# Altium project RCS STM32.PrjPcb
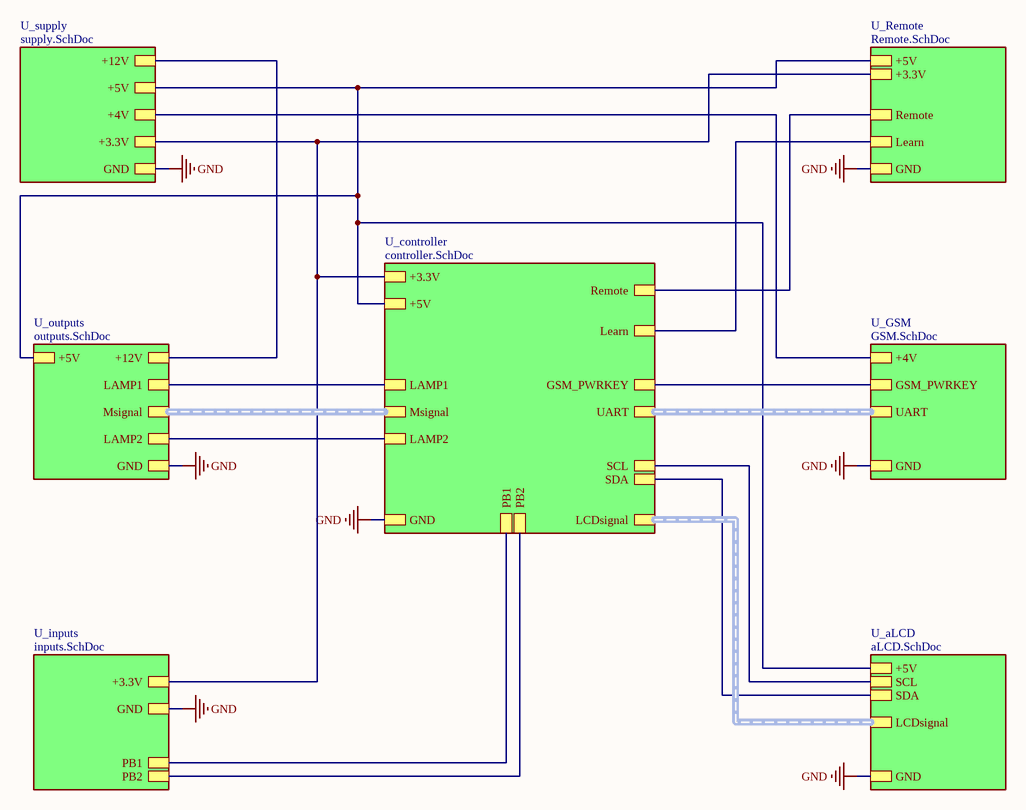
[diagram p0: main.SchDoc]
8 sheets, 165 parts. Net scope: strictly hierarchical (ports join the sheet entries above them; power ports are local).
Board file: PCB.PcbDoc
Sheets:
  main.SchDoc
    U_aLCD = aLCD.SchDoc
    U_controller = controller.SchDoc
    U_GSM = GSM.SchDoc
    U_inputs = inputs.SchDoc
    U_outputs = outputs.SchDoc
    U_Remote = Remote.SchDoc
    U_supply = supply.SchDoc

## Sheet main.SchDoc
size A4; SheetNumber: 1; SheetTotal: 8

### Sub-sheets
U_aLCD = aLCD.SchDoc: +5V, GND, LCDsignal (harness LCDsignal), SCL, SDA
U_controller = controller.SchDoc: +3.3V, GND, Msignal (harness Msignal), LCDsignal (harness LCDsignal), UART (harness UART), Remote, LAMP1, LAMP2, PB1, PB2, +5V, Learn, GSM_PWRKEY, SCL, SDA
U_GSM = GSM.SchDoc: +4V, GND, UART (harness UART), GSM_PWRKEY
U_inputs = inputs.SchDoc: GND, +3.3V, PB1, PB2
U_outputs = outputs.SchDoc: +12V, GND, Msignal (harness Msignal), +5V, LAMP1, LAMP2
U_Remote = Remote.SchDoc: +5V, GND, Remote, Learn, +3.3V
U_supply = supply.SchDoc: +12V, +5V, +4V, +3.3V, GND

### Nets
+3V3: sheet U_controller/+3.3V, sheet U_inputs/+3.3V, sheet U_Remote/+3.3V, sheet U_supply/+3.3V
+4V: sheet U_GSM/+4V, sheet U_supply/+4V
+5V: sheet U_aLCD/+5V, sheet U_controller/+5V, sheet U_outputs/+5V, sheet U_Remote/+5V, sheet U_supply/+5V
+12V: sheet U_outputs/+12V, sheet U_supply/+12V
GND: sheet U_aLCD/GND, sheet U_controller/GND, sheet U_GSM/GND, sheet U_inputs/GND, sheet U_outputs/GND, sheet U_Remote/GND, sheet U_supply/GND
GSM_PWRKEY: sheet U_controller/GSM_PWRKEY, sheet U_GSM/GSM_PWRKEY
LAMP1: sheet U_controller/LAMP1, sheet U_outputs/LAMP1
LAMP2: sheet U_controller/LAMP2, sheet U_outputs/LAMP2
Learn: sheet U_controller/Learn, sheet U_Remote/Learn
PB1: sheet U_controller/PB1, sheet U_inputs/PB1
PB2: sheet U_controller/PB2, sheet U_inputs/PB2
Remote: sheet U_controller/Remote, sheet U_Remote/Remote
SCL: sheet U_aLCD/SCL, sheet U_controller/SCL
SDA: sheet U_aLCD/SDA, sheet U_controller/SDA

### Buses and harness runs
harness sheet U_aLCD/LCDsignal = sheet U_controller/LCDsignal
harness sheet U_controller/Msignal = sheet U_outputs/Msignal
harness sheet U_controller/UART = sheet U_GSM/UART

## Sheet aLCD.SchDoc
size A4; SheetNumber: 7; SheetTotal: 8
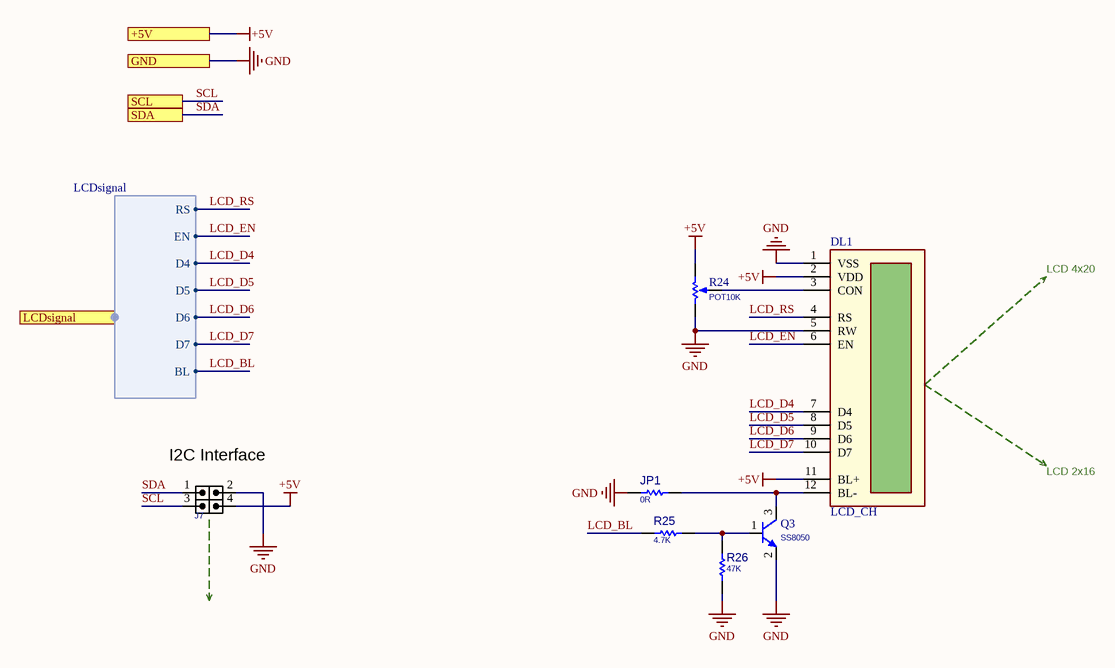
[diagram p1: aLCD.SchDoc]

### Parts
DL1  LCD_CH  [LCD_CH]
J7  HDRM_2X2  [HDR_M_2X2]  (value not drawn)
JP1  0R  [R0805]
Q3  SS8050  [SOT23_3]
R24  POT10K  [POT_7X5]
R25  4.7K  [R0805]
R26  47K  [R0805]

### Ports
+5V, GND, LCDsignal (harness LCDsignal), SCL, SDA

### Harnesses
LCDsignal: RS, EN, D4, D5, D6, D7, BL

### Nets
+5V: DL1.2(VDD) DL1.11(BL+) J7.4 R24.1(TOP) ; port +5V
GND: DL1.1(VSS) DL1.5(RW) J7.2 JP1.2 Q3.2(E) R24.3(BOT) R26.2 ; port GND
LCD_BL: R25.2 ; port LCDsignal.BL
LCD_D4: DL1.7(D4) ; port LCDsignal.D4
LCD_D5: DL1.8(D5) ; port LCDsignal.D5
LCD_D6: DL1.9(D6) ; port LCDsignal.D6
LCD_D7: DL1.10(D7) ; port LCDsignal.D7
LCD_EN: DL1.6(EN) ; port LCDsignal.EN
LCD_RS: DL1.4(RS) ; port LCDsignal.RS
SCL: J7.3 ; port SCL
SDA: J7.1 ; port SDA
NetDL1_3: DL1.3(CON) R24.2(TAP)
NetDL1_12: DL1.12(BL-) JP1.1 Q3.3(C)
NetQ3_1: Q3.1(B) R25.1 R26.1

### Notes on the sheet
- LCD 4x20
- (near J7) I2C Interface
- LCD 2x16

### Library data of the parts
DL1 = LCD_CH: alphanumeric lcd  2x16
J7 = HDR_M_2X2: CONN, HEADER, Male, pitch: 2.54mm, 4POS; MANF_P#: MANF_PART#; MANF: MANF; VALUE: HDRM_2X2
JP1 R25 R26 = RES_SMD_0805: RESISTOR, SMD; PARAM: -W; DESC: DESCRIPTION; DIST#: MOUSER; PARAM2: 1%; MANF_P#: -; MANF: -; ASSEMBLY: ASSEMBLY; PRICE: 100= 0.5$
  JP1: VALUE: 0R
  R25: VALUE: 4.7K
  R26: VALUE: 47K
Q3 = NPN_SS8050_SOT23: BJT, NPN, 25v, 1.5A, SMD, SOT23; PARAM2: 300mW; MANF: GALAXY; PARAM: 25v, 1.5A; MANF_P#: SS8050; VALUE: SS8050
R24 = RES_THD_POT_7X5: RESISTOR, THD, Potentiometer; VALUE: POT10K

## Sheet controller.SchDoc
size A4; SheetNumber: 3; SheetTotal: 8
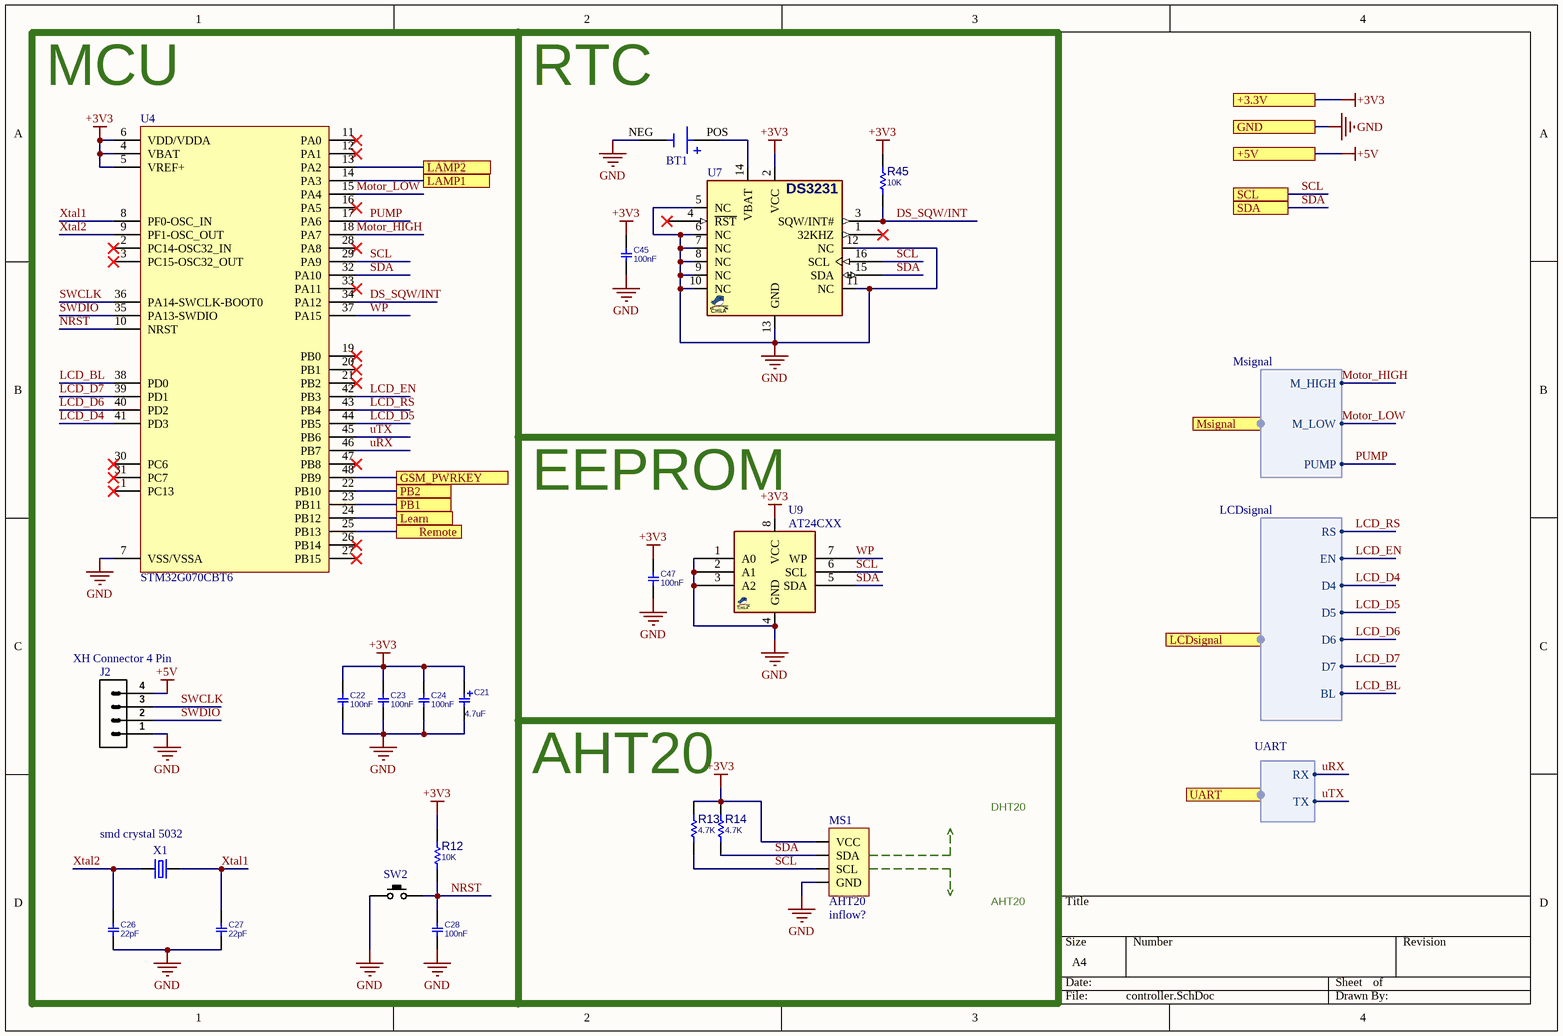
[diagram p2: controller.SchDoc]

### Parts
BT1  Coin Cell battery holder  [Coin Cell battery holder]  (value not drawn)
C21  4.7uF  [C_TN_3216]
C22  100nF  [C0805]
C23  100nF  [C0805]
C24  100nF  [C0805]
C26  22pF  [C0805]
C27  22pF  [C0805]
C28  100nF  [C0805]
C45  100nF  [C0805]
C47  100nF  [C0805]
J2  XH Connector 4 Pin  [XH 4 Pin - 2.5mm]
MS1  Inflow: inflow?  [AHT20]  (hidden comment: AHT20)
R12  10K  [R0805]
R13  4.7K  [R0805]
R14  4.7K  [R0805]
R45  10K  [R0805]
SW2  Tactile Switch  [Tactile Switch]  (value not drawn)
U4  STM32G070CBT6  [STM32G070CBT6]
U7  DS3231  [SO_16_W]  (value not drawn)
U9  AT24CXX  [SO_8]
X1  smd crystal 5032  [smd crystal 5032]

### Blocks framed on the sheet
MCU: C21-C24 C26-C28 J2 R12 SW2 U4 X1

### Ports
+3.3V, +5V, GND, GSM_PWRKEY, LAMP1, LAMP2, LCDsignal (harness LCDsignal), Learn, Msignal (harness Msignal), PB1, PB2, Remote, SCL, SDA, UART (harness UART)

### Harnesses
Msignal: M_HIGH, M_LOW, PUMP
LCDsignal: RS, EN, D4, D5, D6, D7, BL
UART: RX, TX

### Nets
+3V3: C21.1 C22.2 C23.2 C24.2 C45.2 C47.2 MS1.4(VCC) R12.1 R13.1 R14.1 R45.1 U4.4(VBAT) U4.5(VREF+) U4.6(VDD/VDDA) U7.2(VCC) U9.8(VCC) ; port +3.3V
+5V: J2.4 ; port +5V
GND: BT1.NEG C21.2 C22.1 C23.1 C24.1 C26.2 C27.2 C28.1 C45.1 C47.1 J2.1 MS1.3(GND) SW2.1(P1) U4.7(VSS/VSSA) U7.5(NC) U7.6(NC) U7.7(NC) U7.8(NC) U7.9(NC) U7.10(NC) U7.11(NC) U7.12(NC) U7.13(GND) U9.1(A0) U9.2(A1) U9.3(A2) U9.4(GND) ; port GND
DS_SQW/INT: R45.2 U4.34(PA12) U7.3(SQW/INT#)
GSM_PWRKEY: U4.48(PB9) ; port GSM_PWRKEY
LAMP1: U4.14(PA3) ; port LAMP1
LAMP2: U4.13(PA2) ; port LAMP2
LCD_BL: U4.38(PD0) ; port LCDsignal.BL
LCD_D4: U4.41(PD3) ; port LCDsignal.D4
LCD_D5: U4.44(PB5) ; port LCDsignal.D5
LCD_D6: U4.40(PD2) ; port LCDsignal.D6
LCD_D7: U4.39(PD1) ; port LCDsignal.D7
LCD_EN: U4.42(PB3) ; port LCDsignal.EN
LCD_RS: U4.43(PB4) ; port LCDsignal.RS
Learn: U4.24(PB12) ; port Learn
Motor_HIGH: U4.18(PA7) ; port Msignal.M_HIGH
Motor_LOW: U4.15(PA4) ; port Msignal.M_LOW
NRST: C28.2 R12.2 SW2.2(P3) U4.10(NRST)
PB1: U4.23(PB11) ; port PB1
PB2: U4.22(PB10) ; port PB2
PUMP: U4.17(PA6) ; port Msignal.PUMP
Remote: U4.25(PB13) ; port Remote
SCL: MS1.2(SCL) R13.2 U4.29(PA9) U7.16(SCL) U9.6(SCL) ; port SCL
SDA: MS1.1(SDA) R14.2 U4.32(PA10) U7.15(SDA) U9.5(SDA) ; port SDA
SWCLK: J2.3 U4.36(PA14-SWCLK-BOOT0)
SWDIO: J2.2 U4.35(PA13-SWDIO)
uRX: U4.46(PB7) ; port UART.RX
uTX: U4.45(PB6) ; port UART.TX
WP: U4.37(PA15) U9.7(WP)
Xtal1: C27.1 U4.8(PF0-OSC_IN) X1.2
Xtal2: C26.1 U4.9(PF1-OSC_OUT) X1.1
NetBT1_POS: BT1.POS U7.14(VBAT)

Not connected (* = marked no-connect by the designer): U4 1(PC13)* 2(PC14-OSC32_IN)* 3(PC15-OSC32_OUT)* 11(PA0)* 12(PA1)* 16(PA5)* 19(PB0)* 20(PB1)* 21(PB2)* 26(PB14)* 27(PB15)* 28(PA8)* 30(PC6)* 31(PC7)* 33(PA11)* 47(PB8)*; U7 1(32KHZ)* 4(~{RST})*

### Notes on the sheet
- RTC
- (near U9) EEPROM
- AHT20
- DHT20

### Library data of the parts
BT1 = Coin Cell battery holder: 2032 Battery
C21 = CAP_SMD_TAN: CAP, SMD, TAN,; PARAM2: -V; VALUE: 4.7uF
C22-C24 C28 C45 C47 = CAP_SMD_MLCC_0805: CAP, MLCC, -F, -V, MATERIAL, -%, 0201; PARAM: -, -%; MANF_P#: MANF_PART#; PRICE: 100= 1$; MANF: -; PARAM2: -V; ASSEMBLY: ASSEMBLY; VALUE: 100nF
C26 C27 = CAP_SMD_MLCC_0805: CAP, MLCC, -F, -V, MATERIAL, -%, 0201; PARAM: -, -%; MANF_P#: MANF_PART#; VALUE: 100nF; PRICE: 100= 1$; MANF: -; PARAM2: -V; ASSEMBLY: ASSEMBLY
J2 = XH 4: XH, 4-Pin; Current: 3A; Library Link: https://github.com/Majid-Derhambakhsh; Publisher: Majid Derhambakhsh
MS1 = ModSen_AHT20: Air Temperature and Humidity Sensor; Rating: Rating?; Validation: NT; Package: Dip; Type: Air T&H; Value: AHT20
R12-R14 R45 = RES_SMD_0805: as JP1 on sheet aLCD; MANF_P#: -; MANF: -; ASSEMBLY: ASSEMBLY; PRICE: 100= 0.5$
  R12 R45: VALUE: 10K
  R13 R14: VALUE: 4.7K
SW2 = Tactile Switch: 3x6x5 mm - 2 Pin
U4 = STM32G070CBT6: ARMÂ® CortexÂ®-M0+ STM32G0 Microcontroller IC 32-Bit 64MHz 128KB _128K x 8_ FLASH 48-LQFP _7x7_
U7 = DS3231_SOP16W: Real-Time Clock, I2C, +IntCryst; MANF: Maxim Integrated; MANF_P#: DS3231SN#; PARAM2: 2.3~5.5V; PARAM: I2C, +IntCryst, -40~85°C; VALUE: DS3231; PRICE: 10$
U9 = EEPROM_I2C_AT24CXX_SOP8: EEPROM, I2C,; Value: AT24CXX
X1 = smd crystal 5032: 8Mhz - 2Pin - 5032 Package

## Sheet GSM.SchDoc
size A4; SheetNumber: 6; SheetTotal: 8
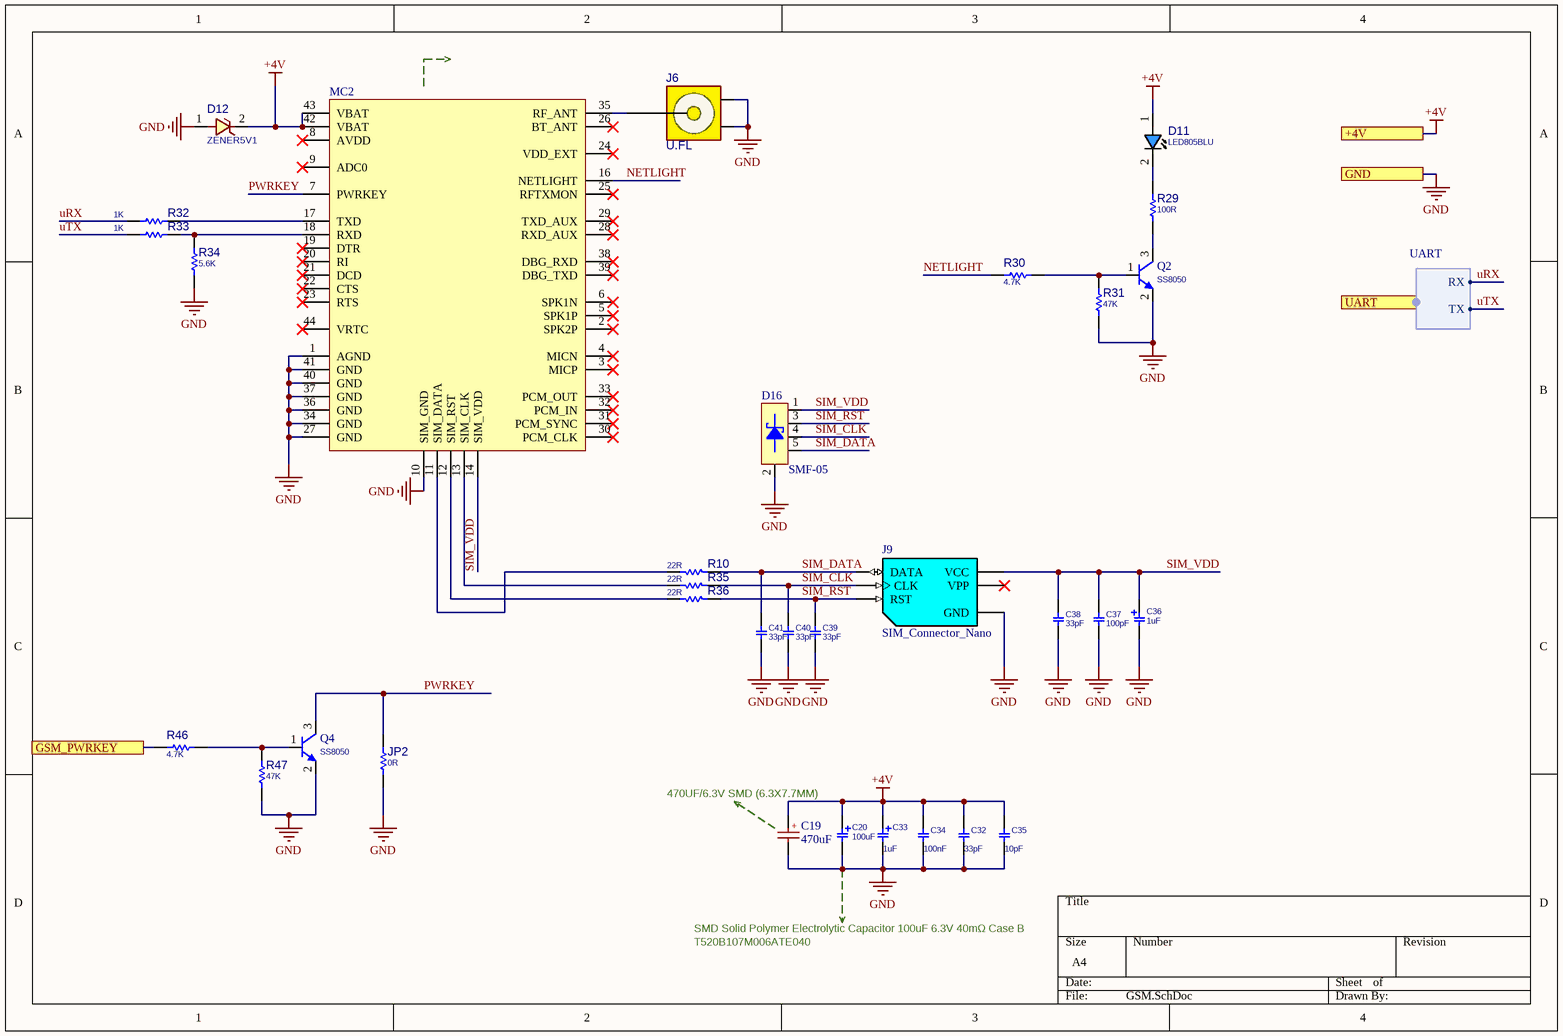
[diagram p3: GSM.SchDoc]

### Parts
C19  470uF  [Cap SMD 6.3x7.7mm]
C20  100uF  [C_TN_3528_BLK]
C32  33pF  [C0603]
C33  1uF  [C_TN_3216]
C34  100nF  [C0805]
C35  10pF  [C0603]
C36  1uF  [C_TN_3216]
C37  100pF  [C0805]
C38  33pF  [C0805]
C39  33pF  [C0805]
C40  33pF  [C0805]
C41  33pF  [C0805]
D11  LED805BLU  [LED0805BLU]
D12  ZENER5V1  [D_SOD123W]
D16  SMF-05  [SC70-5_N]
J6  U.FL  [UFL]
J9  SIM_Connector_Nano  [SIM_Connector_Nano]
JP2  0R  [R0805]
MC2  M66  [m66]  (value not drawn)
Q2  SS8050  [SOT23_3]
Q4  SS8050  [SOT23_3]
R10  22R  [R0805]
R29  100R  [R0805]
R30  4.7K  [R0805]
R31  47K  [R0805]
R32  1K  [R0805]
R33  1K  [R0805]
R34  5.6K  [R0805]
R35  22R  [R0805]
R36  22R  [R0805]
R46  4.7K  [R0805]
R47  47K  [R0805]

### Ports
+4V, GND, GSM_PWRKEY, UART (harness UART)

### Harnesses
UART: RX, TX

### Nets
+4V: C19.1(+) C20.1 C32.1 C33.1 C34.2 C35.1 D11.1(ANODE) D12.2 MC2.42(VBAT) MC2.43(VBAT) ; port +4V
GND: C19.2(-) C20.2 C32.2 C33.2 C34.1 C35.2 C36.2 C37.1 C38.1 C39.1 C40.1 C41.1 D12.1 D16.2(K) J6.2(G1) J6.3(G2) J9.C5(GND) JP2.1 MC2.1(AGND) MC2.10(SIM_GND) MC2.27(GND) MC2.34(GND) MC2.36(GND) MC2.37(GND) MC2.40(GND) MC2.41(GND) Q2.2(E) Q4.2(E) R31.1 R34.1 R47.1 ; port GND
GSM_PWRKEY: R46.1 ; port GSM_PWRKEY
NETLIGHT: MC2.16(NETLIGHT) R30.1
PWRKEY: JP2.2 MC2.7(PWRKEY) Q4.3(C)
SIM_CLK: C40.2 D16.4(K) J9.C3(CLK) R35.1
SIM_DATA: C41.2 D16.5(K) J9.C7(DATA) R10.1
SIM_RST: C39.2 D16.3(K) J9.C2(RST) R36.1
SIM_VDD: C36.1 C37.2 C38.2 D16.1(K) J9.C1(VCC) MC2.14(SIM_VDD)
uRX: R32.1 ; port UART.RX
uTX: R33.1 ; port UART.TX
NetD11_2: D11.2(CATHODE) R29.2
NetJ6_1: J6.1(SIG) MC2.35(RF_ANT)
NetMC2_11: MC2.11(SIM_DATA) R10.2
NetMC2_12: MC2.12(SIM_RST) R36.2
NetMC2_13: MC2.13(SIM_CLK) R35.2
NetMC2_17: MC2.17(TXD) R32.2
NetMC2_18: MC2.18(RXD) R33.2 R34.2
NetQ2_1: Q2.1(B) R30.2 R31.2
NetQ2_3: Q2.3(C) R29.1
NetQ4_1: Q4.1(B) R46.2 R47.2

Not connected (* = marked no-connect by the designer): J9 C6(VPP)*; MC2 2(SPK2P)* 3(MICP)* 4(MICN)* 5(SPK1P)* 6(SPK1N)* 8(AVDD)* 9(ADC0)* 19(DTR)* 20(RI)* 21(DCD)* 22(CTS)* 23(RTS)* 24(VDD_EXT)* 25(RFTXMON)* 26(BT_ANT)* 28(RXD_AUX)* 29(TXD_AUX)* 30(PCM_CLK)* 31(PCM_SYNC)* 32(PCM_IN)* 33(PCM_OUT)* 38(DBG_RXD)* 39(DBG_TXD)* 44(VRTC)*

### Notes on the sheet
- 470UF/6.3V SMD (6.3X7.7MM)
- SMD Solid Polymer Electrolytic Capacitor 100uF 6.3V 40mΩ Case B
- T520B107M006ATE040

### Library data of the parts
C19 = CAP Electrolytic SMD: SMD Aluminum Electrolytic Capacitor; Desc: SMD Aluminum Electrolytic Capacitors; Value: 100uF; Voltage: 12v; Tolerance: 5%; Library Link: https://github.com/Majid-Derhambakhsh; Publisher: Majid Derhambakhsh
C20 = CAP_SMD_TAN_4: CAP, SMD, TAN; PARAM: 20%, 300mOhm, -55~105oC; MANF: VISHAY; MANF_P#: T55A106M6R3C0300; PARAM2: 6.3V; PRICE: 0.46$; VALUE: 100uF
C32 C35 = CAP_SMD_MLCC_0603: CAP, MLCC, -F, -V, MATERIAL, -%, 0201; PARAM: -, -%; MANF_P#: MANF_PART#; PRICE: 100= 1$; MANF: -; PARAM2: -V; ASSEMBLY: ASSEMBLY
  C32: VALUE: 33pF
  C35: VALUE: 10pF
C33 C36 = CAP_SMD_TAN: CAP, SMD, TAN,; PARAM2: -V; VALUE: 1uF
C34 C37-C41 = CAP_SMD_MLCC_0805: as C22 on sheet controller; PRICE: 100= 1$; MANF: -; PARAM2: -V; ASSEMBLY: ASSEMBLY
  C34: VALUE: 100nF
  C37: VALUE: 100pF
  C38-C41: VALUE: 33pF
D11 = LED_SMD_0805_BLU: LED, SMD, 0805, BLUE; DESC: DESCRIPTION; MANF_P#: MANF_PART#; PARAM2: 2.2V; MANF: MANF; ASSEMBLY: ASSEMBLY; PRICE: 36t@Javan; VALUE: LED805BLU
D12 = DIODE_SMD_ZENER_BZT52HC5V1: DIODE, ZENER, 1W, 5.1V; MANF: Diodes; DESC: DESCRIPTION; PARAM2: 1W, 4Ohm, -55~150oC; MANF_P#: BZT52HC5V1WF-7; ASSEMBLY: ASSEMBLY; PRICE: 0.25$; PARAM: 5.1V; VALUE: ZENER5V1
D16 = Semi_Diod_TVS_SMF05: TVS Diode Array; Rating: Rating?; Validation: Valid; Inflow: inflow?; Type: TVS; Value: SMF-05; Package: SC70-5
J6 = CONN_RF_UFL: CONN, RF, U.FL, STRAIGHT, Ultra Miniature Coaxial; MANF_P#: CONUFL001-SMD, U.FL-R-SMT-1(10), 128-0711-201; MANF: Linx, Hirose, Cinch; PARAM: 50Ohm, 6GHz; DESC: DESCRIPTION; DIST#: DIGIKEY, MOUSER; PARAM2: GOLD; ASSEMBLY: ASSEMBLY; PRICE: 0.9$; VALUE: U.FL
J9 = SIM_Connector_Nano: Nano SimCard Holder 6P
JP2 R10 R29-R36 R46 R47 = RES_SMD_0805: as JP1 on sheet aLCD; MANF_P#: -; MANF: -; ASSEMBLY: ASSEMBLY; PRICE: 100= 0.5$
  JP2: VALUE: 0R
  R10 R35 R36: VALUE: 22R
  R29: VALUE: 100R
  R30 R46: VALUE: 4.7K
  R31 R47: VALUE: 47K
  R32 R33: VALUE: 1K
  R34: VALUE: 5.6K
MC2 = ModSen_Com_M66: Quectel GSM/GPRS Module; Rating: Rating?; Validation: Valid; Inflow: inflow?; Package: Dip; Value: M66; Type: GSM-GPRS
Q2 Q4 = NPN_SS8050_SOT23: as Q3 on sheet aLCD; PARAM: 25v, 1.5A; MANF_P#: SS8050; VALUE: SS8050

## Sheet inputs.SchDoc
size A4; SheetNumber: 5; SheetTotal: 8
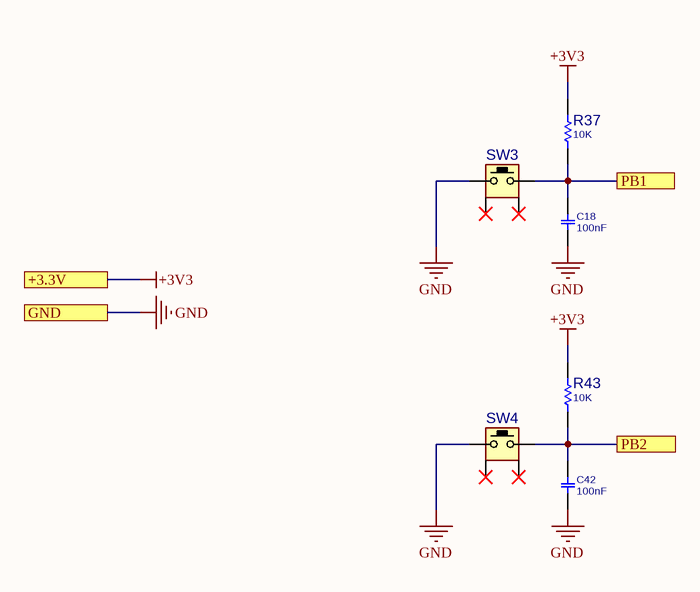
[diagram p4: inputs.SchDoc]

### Parts
C18  100nF  [C0805]
C42  100nF  [C0805]
R37  10K  [R0805]
R43  10K  [R0805]
SW3  PUSHBUTTON  [SWPBT_SPST_R_6X6X10]  (value not drawn)
SW4  PUSHBUTTON  [SWPBT_SPST_R_6X6X10]  (value not drawn)

### Ports
+3.3V, GND, PB1, PB2

### Nets
+3V3: R37.1 R43.1 ; port +3.3V
GND: C18.1 C42.1 SW3.1 SW4.1 ; port GND
PB1: C18.2 R37.2 SW3.2 ; port PB1
PB2: C42.2 R43.2 SW4.2 ; port PB2

Not connected (* = marked no-connect by the designer): SW3 MH1* MH2*; SW4 MH1* MH2*

### Library data of the parts
C18 C42 = CAP_SMD_MLCC_0805: as C22 on sheet controller; PRICE: 100= 1$; MANF: -; PARAM2: -V; ASSEMBLY: ASSEMBLY; VALUE: 100nF
R37 R43 = RES_SMD_0805: as JP1 on sheet aLCD; MANF_P#: -; MANF: -; ASSEMBLY: ASSEMBLY; PRICE: 100= 0.5$; VALUE: 10K
SW3 SW4 = SWPBT_SPST_R_6X6X10: SWITCH, PUSH BUTTON, TACTILE, THD, SPST, RIGHT; PARAM: 50mA/12VDC; DESC: DESCRIPTION; MANF: -; VALUE: PUSHBUTTON; ASSEMBLY: ASSEMBLY; PRICE: 0.3$; MANF_P#: -

## Sheet outputs.SchDoc
size A4; SheetNumber: 4; SheetTotal: 8
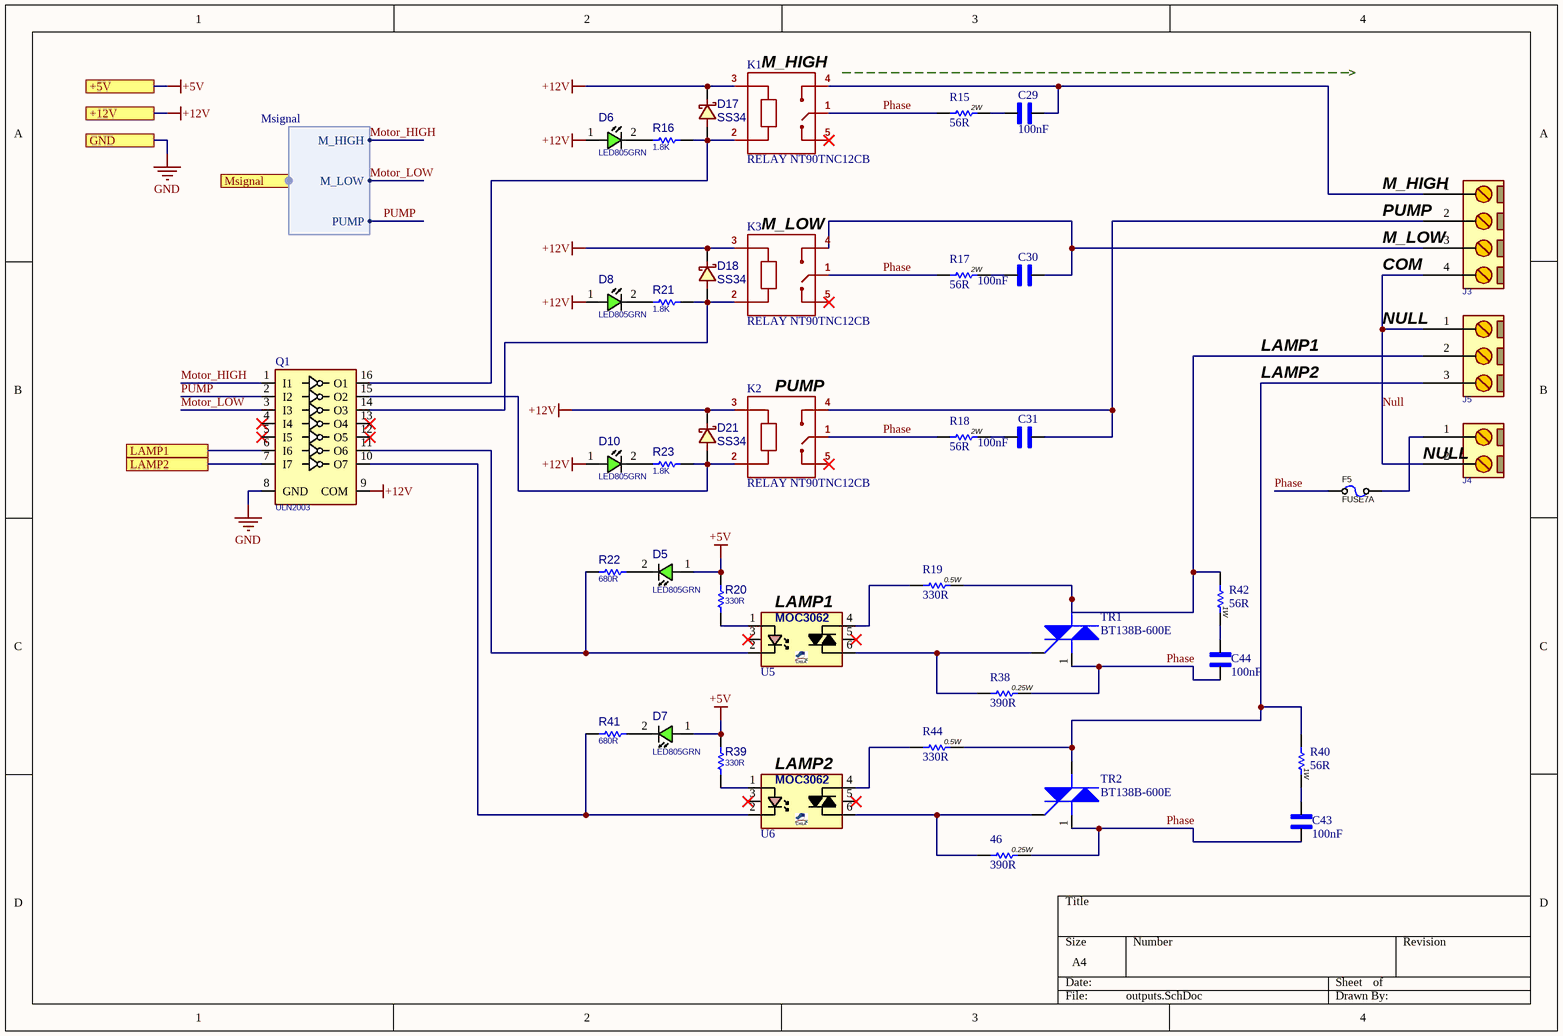
[diagram p5: outputs.SchDoc]

### Parts
46  390R  [Res THD 0.25w]
C29  100nF  [Capacitor Film]
C30  100nF  [Capacitor Film]
C31  100nF  [Capacitor Film]
C43  100nF  [Capacitor Film]
C44  100nF  [Capacitor Film]
D5  LED805GRN  [LED0805GRN]
D6  LED805GRN  [LED0805GRN]
D7  LED805GRN  [LED0805GRN]
D8  LED805GRN  [LED0805GRN]
D10  LED805GRN  [LED0805GRN]
D17  SS34  [D_SMB]
D18  SS34  [D_SMB]
D21  SS34  [D_SMB]
F5  FUSE7A  [FUSH_5X20MM]
J3  CONN_GMSTB4  [GMSTB762_4]  (value not drawn)
J4  CONN_GMSTB2  [GMSTB762_2]  (value not drawn)
J5  CONN_GMSTB3  [GMSTB762_3]  (value not drawn)
K1  RELAY NT90TNC12CB  [RELAY NT90TNC12CB]
K2  RELAY NT90TNC12CB  [RELAY NT90TNC12CB]
K3  RELAY NT90TNC12CB  [RELAY NT90TNC12CB]
Q1  ULN2003  [SO_16]
R15  56R  [Res THD 2w]
R16  1.8K  [R0805]
R17  56R  [Res THD 2w]
R18  56R  [Res THD 2w]
R19  330R  [Res THD 0.5w]
R20  330R  [R0805]
R21  1.8K  [R0805]
R22  680R  [R0805]
R23  1.8K  [R0805]
R38  390R  [Res THD 0.25w]
R39  330R  [R0805]
R40  56R  [Res THD 1w]
R41  680R  [R0805]
R42  56R  [Res THD 1w]
R44  330R  [Res THD 0.5w]
TR1  BT138B-600E  [BT138B-600E]
TR2  BT138B-600E  [BT138B-600E]
U5  MOC3062  [DIP_6SMD]  (value not drawn)
U6  MOC3062  [DIP_6SMD]  (value not drawn)

### Ports
+5V, +12V, GND, LAMP1, LAMP2, Msignal (harness Msignal)

### Harnesses
Msignal: M_HIGH, M_LOW, PUMP

### Nets
+5V: D5.1(ANODE) D7.1(ANODE) R20.1 R39.1 ; port +5V
+12V: D6.1(ANODE) D8.1(ANODE) D10.1(ANODE) D17.2 D18.2 D21.2 K1.3(A) K2.3(A) K3.3(A) Q1.9(COM) ; port +12V
GND: Q1.8(GND) ; port GND
LAMP1: Q1.6(I6) ; port LAMP1
LAMP2: Q1.7(I7) ; port LAMP2
Motor_HIGH: Q1.1(I1) ; port Msignal.M_HIGH
Motor_LOW: Q1.3(I3) ; port Msignal.M_LOW
Null: J3.4 J4.2 J5.1
Phase: 46.2 C43.2 C44.2 F5.1 K1.1(COM) K2.1(COM) K3.1(COM) R15.1 R17.1 R18.1 R38.2 TR1.1(T1) TR2.1(T1)
PUMP: Q1.2(I2) ; port Msignal.PUMP
Net46_1: 46.1 TR2.3(G) U6.6(A/K)
NetC29_1: C29.1 R15.2
NetC29_2: C29.2 J3.1 K1.4(N.O)
NetC30_1: C30.1 R17.2
NetC30_2: C30.2 J3.3 K3.4(N.O)
NetC31_1: C31.1 R18.2
NetC31_2: C31.2 J3.2 K2.4(N.O)
NetC43_1: C43.1 R40.2
NetC44_1: C44.1 R42.2
NetD5_2: D5.2(CATHODE) R22.1
NetD6_2: D6.2(CATHODE) R16.1
NetD7_2: D7.2(CATHODE) R41.1
NetD8_2: D8.2(CATHODE) R21.1
NetD10_2: D10.2(CATHODE) R23.1
NetD17_1: D17.1 K1.2(A) Q1.16(O1) R16.2
NetD18_1: D18.1 K3.2(A) Q1.14(O3) R21.2
NetD21_1: D21.1 K2.2(A) Q1.15(O2) R23.2
NetF5_2: F5.2 J4.1
NetJ5_2: J5.2 R19.2 R42.1 TR1.2_4(T2)
NetJ5_3: J5.3 R40.1 R44.2 TR2.2_4(T2)
NetQ1_10: Q1.10(O7) R41.2 U6.2(K)
NetQ1_11: Q1.11(O6) R22.2 U5.2(K)
NetR19_1: R19.1 U5.4(A/K)
NetR20_2: R20.2 U5.1(A)
NetR38_1: R38.1 TR1.3(G) U5.6(A/K)
NetR39_2: R39.2 U6.1(A)
NetR44_1: R44.1 U6.4(A/K)

Not connected (* = marked no-connect by the designer): K1 5(N.C)*; K2 5(N.C)*; K3 5(N.C)*; Q1 4(I4)* 5(I5)* 12(O5)* 13(O4)*; U5 3(NC)* 5(NC)*; U6 3(NC)* 5(NC)*

### Notes on the sheet
- (near K1) M_HIGH
- (near K3) M_LOW
- (near J3) PUMP
- (near J3) M_HIGH
- (near J3) M_LOW
- COM
- LAMP2
- LAMP1
- NULL
- (near K2) PUMP
- (near J4) NULL
- (near U5) LAMP1
- (near U6) LAMP2
- (in symbol Res THD 0.5w) 0.5W
- (in symbol Res THD 0.25w) 0.25W

### Library data of the parts
46 R38 = Res THD 0.25w: Resistor 1/4W; Rating: 0.25w; Value: 390R; Type: 10%; Package: THD
C29-C31 C43 C44 = Capacitor Film: Capacitor Film Pitch=10mm
D5-D8 D10 = LED_SMD_0805_GRN: LED, SMD, 0805, GREEN; PARAM: 20mA; DESC: DESCRIPTION; PARAM2: 2.2V; MANF: -; ASSEMBLY: ASSEMBLY; PRICE: 36t@Javan; MANF_P#: -; VALUE: LED805GRN
D17 D18 D21 = DIODE_SMD_SCHOTTKY_SS34: DIODE, SCHOTTKY, 20V, 3A; MANF: VISHAY; DESC: DESCRIPTION; MANF_P#: SS34; ASSEMBLY: ASSEMBLY; PRICE: PRICE; PARAM2: 3A; PARAM: 20V; VALUE: SS34
F5 = FUSE_5X20: Fuse HOLDER 5X20; PARAM: 2A; MANF_P#: MANF_PART#; MANF: MANF; PARAM2: PARAM2; VALUE: FUSE7A
J3 = CONN_GMSTB762_4: CONN, PHOENIX MSTB, 5-G, 5.08mm pitch; MANF_P#: GMSTB 2,5/4-G-7,62; VALUE: CONN_GMSTB4
J4 = CONN_GMSTB762_2: CONN, PHOENIX GMSTB, 7.62mm pitch; MANF_P#: GMSTB 2,5/2-G-7,62; VALUE: CONN_GMSTB2
J5 = CONN_GMSTB762_3: CONN, PHOENIX MSTB, 5-G, 5.08mm pitch; MANF_P#: GMSTB 2,5/3-G-7,62; VALUE: CONN_GMSTB3
K1-K3 = RELAY NT90TNC12CB: Relay SPDT POWER NEEDLE; Value: RELAY NT90TNC12CB; Library Link: https://github.com/Majid-Derhambakhsh; Publisher: Majid Derhambakhsh
Q1 = ULN2003_SOP16_ST: Darlington, 7-CH, 50V, 0.5A, 5V TTL/CMOS; MANF_P#: ULN2003D1; MANF: ST; PARAM: 7-CH, 50V, 0.5A; PARAM2: 5V TTL/CMOS; VALUE: ULN2003
R15 R17 R18 = Res THD 2w: Resistor 2W; Value: 56R; Rating: 2W; Type: 10%; Package: THD
R16 R20-R23 R39 R41 = RES_SMD_0805: as JP1 on sheet aLCD; MANF_P#: -; MANF: -; ASSEMBLY: ASSEMBLY; PRICE: 100= 0.5$
  R16 R21 R23: VALUE: 1.8K
  R20 R39: VALUE: 330R
  R22 R41: VALUE: 680R
R19 R44 = Res THD 0.5w: Resistor 1/2W; Rating: 0.5w; Value: 330R; Type: 10%; Package: THD
R40 R42 = Res THD 1w: Resistor 1W; Value: 56R; Rating: 1W; Type: 10%; Package: THD
TR1 TR2 = BT138B-600E: Triac 600V, 12A
U5 U6 = OPT_TRIAC6P_MOC3062SMD: OPTOTRIAC, 600v/1A, 6v In; PARAM2: 300mW, -40~85°C; PARAM: 6v/60mA IN/ 600v/1A out, 10mA LED; MANF_P#: MOC3062; PRICE: 7t@paya; VALUE: MOC3062

## Sheet Remote.SchDoc
size A4; SheetNumber: 8; SheetTotal: 8
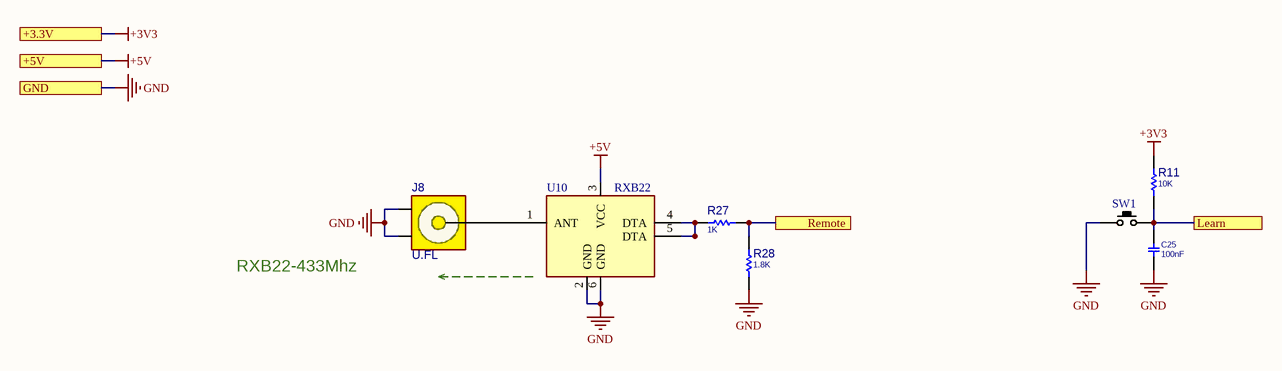
[diagram p6: Remote.SchDoc]

### Parts
C25  100nF  [C0805]
J8  U.FL  [UFL]
R11  10K  [R0805]
R27  1K  [R0805]
R28  1.8K  [R0805]
SW1  Tactile Switch  [Tactile Switch]  (value not drawn)
U10  RXB22  [RXB22]

### Ports
+3.3V, +5V, GND, Learn, Remote

### Nets
+3V3: R11.1 ; port +3.3V
+5V: U10.3(VCC) ; port +5V
GND: C25.1 J8.2(G1) J8.3(G2) R28.1 SW1.1(P1) U10.2(GND) U10.6(GND) ; port GND
Learn: C25.2 R11.2 SW1.2(P3) ; port Learn
Remote: R27.2 R28.2 ; port Remote
NetJ8_1: J8.1(SIG) U10.1(ANT)
NetR27_1: R27.1 U10.4(DTA) U10.5(DTA)

### Notes on the sheet
- RXB22-433Mhz

### Library data of the parts
C25 = CAP_SMD_MLCC_0805: as C22 on sheet controller; PRICE: 100= 1$; MANF: -; PARAM2: -V; ASSEMBLY: ASSEMBLY; VALUE: 100nF
J8 = CONN_RF_UFL: as J6 on sheet GSM; ASSEMBLY: ASSEMBLY; PRICE: 0.9$; VALUE: U.FL
R11 R27 R28 = RES_SMD_0805: as JP1 on sheet aLCD; MANF_P#: -; MANF: -; ASSEMBLY: ASSEMBLY; PRICE: 100= 0.5$
  R11: VALUE: 10K
  R27: VALUE: 1K
  R28: VALUE: 1.8K
SW1 = Tactile Switch: 3x6x5 mm - 2 Pin
U10 = RXB22: RF Receiver 433Mhz

## Sheet supply.SchDoc
size A4; SheetNumber: 2; SheetTotal: 8
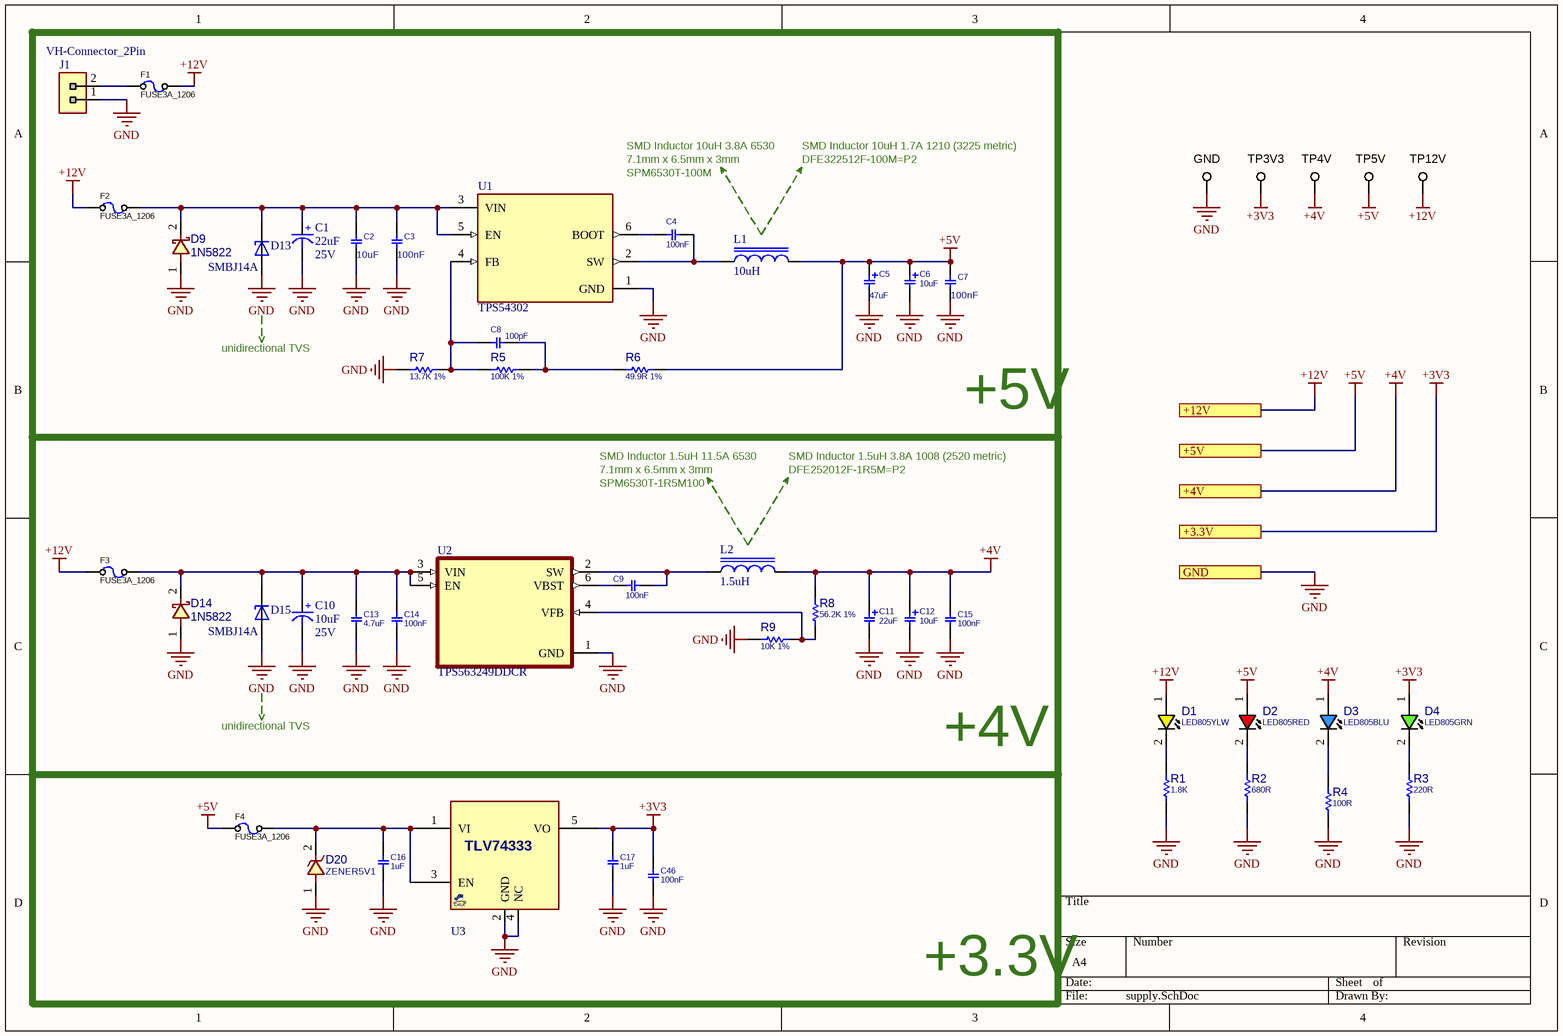
[diagram p7: supply.SchDoc]

### Parts
C1  (no value)  [Capacitor Aluminum 5.0×5.4]
C2  10uF  [C1206]
C3  100nF  [C1206]
C4  100nF  [C0603]
C5  47uF  [C_TN_3528]
C6  10uF  [C_TN_3216]
C7  100nF  [C1206]
C8  100pF  [C0603]
C9  100nF  [C0603]
C10  (no value)  [Capacitor Aluminum 4×5.4]
C11  22uF  [C_TN_3216]
C12  10uF  [C_TN_3216]
C13  4.7uF  [C1206]
C14  100nF  [C1206]
C15  100nF  [C1206]
C16  1uF  [C1206]
C17  1uF  [C1206]
C46  100nF  [C1206]
D1  LED805YLW  [LED0805YLW]
D2  LED805RED  [LED0805RED]
D3  LED805BLU  [LED0805BLU]
D4  LED805GRN  [LED0805GRN]
D9  1N5822  [D_SMA]
D13  SMBJ14A  [SMBJ14A]
D14  1N5822  [D_SMA]
D15  SMBJ14A  [SMBJ14A]
D20  ZENER5V1  [D_SOD123W]
F1  FUSE3A_1206  [F1206]
F2  FUSE3A_1206  [F1206]
F3  FUSE3A_1206  [F1206]
F4  FUSE3A_1206  [F1206]
GND  TESTPOINT_SMD  [TPSMD_S1]  (value not drawn)  (no BOM)
J1  VH-Connector_2Pin  [VH-Connector_2Pin]
L1  10uH  [SMD Inductor 2]
L2  1.5uH  [SMD Inductor 2]
R1  1.8K  [R0805]
R2  680R  [R0805]
R3  220R  [R0805]
R4  100R  [R0805]
R5  100K 1%  [R0603]
R6  49.9R 1%  [R0603]
R7  13.7K 1%  [R0603]
R8  56.2K 1%  [R0603]
R9  10K 1%  [R0603]
TP3V3  TESTPOINT_SMD  [TPSMD_S1]  (value not drawn)  (no BOM)
TP4V  TESTPOINT_SMD  [TPSMD_S1]  (value not drawn)  (no BOM)
TP5V  TESTPOINT_SMD  [TPSMD_S1]  (value not drawn)  (no BOM)
TP12V  TESTPOINT_SMD  [TPSMD_S1]  (value not drawn)  (no BOM)
U1  TPS54302  [TPS54302]
U2  TPS563249DDCR  [TPS563249DDCR]
U3  TLV74333  [SOT23_5]  (value not drawn)

### Ports
+3.3V, +4V, +5V, +12V, GND

### Nets
+3V3: C17.1 C46.1 D4.1(ANODE) TP3V3.1 U3.5(VO) ; port +3.3V
+4V: C11.1 C12.1 C15.1 D3.1(ANODE) L2.2 R8.2 TP4V.1 ; port +4V
+5V: C5.1 C6.1 C7.2 D2.1(ANODE) F4.1 L1.2 R6.2 TP5V.1 ; port +5V
+12V: D1.1(ANODE) F1.2 F2.1 F3.1 TP12V.1 ; port +12V
GND: C1.2(-) C2.1 C3.1 C5.2 C6.2 C7.1 C10.2(-) C11.2 C12.2 C13.2 C14.2 C15.2 C16.2 C17.2 C46.2 D9.1 D13.A D14.1 D15.A D20.1 GND.1 J1.1 R1.2 R2.2 R3.2 R4.2 R7.1 R9.1 U1.1(GND) U2.1(GND) U3.2(GND) U3.4(NC) ; port GND
NetC1_1: C1.1(+) C2.2 C3.2 D9.2 D13.C F2.2 U1.3(VIN) U1.5(EN)
NetC4_1: C4.1 U1.6(BOOT)
NetC4_2: C4.2 L1.1 U1.2(SW)
NetC8_1: C8.1 R5.1 R7.2 U1.4(FB)
NetC8_2: C8.2 R5.2 R6.1
NetC9_1: C9.1 U2.6(VBST)
NetC9_2: C9.2 L2.1 U2.2(SW)
NetC10_1: C10.1(+) C13.1 C14.1 D14.2 D15.C F3.2 U2.3(VIN) U2.5(EN)
NetC16_1: C16.1 D20.2 F4.2 U3.1(VI) U3.3(EN)
NetD1_2: D1.2(CATHODE) R1.1
NetD2_2: D2.2(CATHODE) R2.1
NetD3_2: D3.2(CATHODE) R4.1
NetD4_2: D4.2(CATHODE) R3.1
NetF1_1: F1.1 J1.2
NetR8_1: R8.1 R9.2 U2.4(VFB)

### Notes on the sheet
- (near U1) SPM6530T-100M
- SMD Inductor 10uH 3.8A 6530
- 7.1mm x 6.5mm x 3mm
- DFE322512F-100M=P2
- SMD Inductor 10uH 1.7A 1210 (3225 metric)
- unidirectional TVS
- +5V
- SPM6530T-1R5M100
- SMD Inductor 1.5uH 11.5A 6530
- DFE252012F-1R5M=P2
- SMD Inductor 1.5uH 3.8A 1008 (2520 metric)
- +4V
- +3.3V
- (in symbol Capacitor Aluminum Electrolytic SMD) 10uF; 25V; 22uF

### Library data of the parts
C1 C10 = Capacitor Aluminum Electrolytic SMD
C2 C3 C7 = CAP_SMD_MLCC_1206: CAP, MLCC; PARAM: -, -%; MANF_P#: MANF_PART#; PARAM2: -V; PRICE: 100= 1$; MANF: -; ASSEMBLY: ASSEMBLY
C4 C8 C9 = CAP_SMD_MLCC_0603: as C32 on sheet GSM; PRICE: 100= 1$; MANF: -; PARAM2: -V; ASSEMBLY: ASSEMBLY
  C4 C9: VALUE: 100nF
  C8: VALUE: 100pF
C5 = CAP_SMD_TAN_3528: CAP, SMD, TAN,; PARAM2: -V; VALUE: 47uF
C6 C11 C12 = CAP_SMD_TAN: CAP, SMD, TAN,; PARAM2: -V
  C6 C12: VALUE: 10uF
  C11: VALUE: 22uF
C13-C17 C46 = CAP_SMD_MLCC_1206: CAP, MLCC, -F, -V, MATERIAL, -%, 0201; PARAM: -, -%; MANF_P#: MANF_PART#; PRICE: 100= 1$; MANF: -; PARAM2: -V; ASSEMBLY: ASSEMBLY
  C13: VALUE: 4.7uF
  C14 C15 C46: VALUE: 100nF
  C16 C17: VALUE: 1uF
D1 = LED_SMD_0805_YLW: LED, SMD, 0805, YELLOW; DESC: DESCRIPTION; MANF_P#: MANF_PART#; PARAM2: 2.2V; MANF: MANF; ASSEMBLY: ASSEMBLY; PRICE: 36t@Javan; VALUE: LED805YLW
D2 = LED_SMD_0805_RED: LED, SMD, 0805, RED; DESC: DESCRIPTION; MANF_P#: MANF_PART#; PARAM2: 2.2V; MANF: MANF; ASSEMBLY: ASSEMBLY; PRICE: 36t@Javan; VALUE: LED805RED
D3 = LED_SMD_0805_BLU: as D11 on sheet GSM; MANF: MANF; ASSEMBLY: ASSEMBLY; PRICE: 36t@Javan; VALUE: LED805BLU
D4 = LED_SMD_0805_GRN: as D5 on sheet outputs; MANF: -; ASSEMBLY: ASSEMBLY; PRICE: 36t@Javan; MANF_P#: -; VALUE: LED805GRN
D9 D14 = DIODE_SMD_SCHOTTKY_1N5822: DIODE, SCHOTTKY, 40V, 3A; MANF: DIODES; DESC: DESCRIPTION; MANF_P#: 1N5822; ASSEMBLY: ASSEMBLY; PRICE: PRICE; PARAM2: 3A; PARAM: 40V; VALUE: 1N5822
D13 D15 = SMBJ14A: TVS Diode Uni-directional 14V SMB
D20 = DIODE_SMD_ZENER_BZT52HC5V1: as D12 on sheet GSM; ASSEMBLY: ASSEMBLY; PRICE: 0.25$; PARAM: 5.1V; VALUE: ZENER5V1
F1 = FUSE_3A_1206_SLOW: Fuse, 3A, 32VDC, 1206, SMD, Slow Blow; PARAM: 3A; 32VDC; Slow Blow; MANF: Bourns; MANF_P#: SF-1206SP300-2; PARAM2: 0.027Ohm; PRICE: 0.9$; VALUE: FUSE3A_1206
F2-F4 = FUSE_3A_1206_SLOW: Fuse, 3A, 32VDC, 1206, SMD, Slow Blow; PARAM: 2A; 32VDC; Slow Blow; MANF: Bourns; MANF_P#: SF-1206SP300-2; PARAM2: 0.027Ohm; PRICE: 0.9$; VALUE: FUSE3A_1206
GND TP3V3 TP4V TP5V TP12V = TESTPOINT_SMD: TEST POINT; MANF: MANF; MANF_P#: MANF_P#; VALUE: VALUE
L1 L2 = SMD Inductor 2: 7.1mm x 6.5mm x 3mm (6530) part number : SPM6530T-1R5M100
R1-R4 = RES_SMD_0805: as JP1 on sheet aLCD; MANF_P#: -; MANF: -; ASSEMBLY: ASSEMBLY; PRICE: 100= 0.5$
  R1: VALUE: 1.8K
  R2: VALUE: 680R
  R3: VALUE: 220R
  R4: VALUE: 100R
R5-R9 = RES_SMD_0603: RESISTOR, SMD; PARAM: -W; DESC: DESCRIPTION; DIST#: MOUSER; MANF_P#: -; MANF: -; ASSEMBLY: ASSEMBLY; PRICE: 100= 0.5$; PARAM2: 1%
  R5: VALUE: 100K 1%
  R6: VALUE: 49.9R 1%
  R7: VALUE: 13.7K 1%
  R8: VALUE: 56.2K 1%
  R9: VALUE: 10K 1%
U1 = TPS54302: 4.5-V to 28-V Input, 3-A Output, EMI Friendly / Synchronous Step-Down Converter
U2 = TPS563249DDCR: 17-V, 3-A, constant 1.4-MHz synchronous step-down voltage regulator
U3 = VREG_TLV74333_SOT23: REG, Linear, LDO0.12V, Fixed, 300mA, VIN1.4~5.5V, VOUT1~5.5V, SOT-23-5; MANF: Texas Instruments; MANF_P#: TLV74333PDQN; PARAM2: 1.4~5.5Vin, LDO0.12V, Fixed3.0V; PARAM: 300mA, 50dB PSRR, -40~125°C; PRICE: $0.3; VALUE: TLV74333

## Nets that join several sheets
+3V3: controller (16 pins), inputs (R37.1 R43.1), Remote (R11.1), supply (5 pins)
+4V: GSM (10 pins), supply (7 pins)
+5V: aLCD (DL1.2 DL1.11 J7.4 R24.1), controller (J2.4), outputs (D5.1 D7.1 R20.1 R39.1), Remote (U10.3), supply (8 pins)
+12V: outputs (10 pins), supply (5 pins)
GND: aLCD (7 pins), controller (27 pins), GSM (31 pins), inputs (C18.1 C42.1 SW3.1 SW4.1), outputs (Q1.8), Remote (7 pins), supply (32 pins)
GSM_PWRKEY: controller (U4.48), GSM (R46.1)
LAMP1: controller (U4.14), outputs (Q1.6)
LAMP2: controller (U4.13), outputs (Q1.7)
LCD_BL: aLCD (R25.2), controller (U4.38)
LCD_D4: aLCD (DL1.7), controller (U4.41)
LCD_D5: aLCD (DL1.8), controller (U4.44)
LCD_D6: aLCD (DL1.9), controller (U4.40)
LCD_D7: aLCD (DL1.10), controller (U4.39)
LCD_EN: aLCD (DL1.6), controller (U4.42)
LCD_RS: aLCD (DL1.4), controller (U4.43)
Learn: controller (U4.24), Remote (C25.2 R11.2 SW1.2)
Motor_HIGH: controller (U4.18), outputs (Q1.1)
Motor_LOW: controller (U4.15), outputs (Q1.3)
PB1: controller (U4.23), inputs (C18.2 R37.2 SW3.2)
PB2: controller (U4.22), inputs (C42.2 R43.2 SW4.2)
PUMP: controller (U4.17), outputs (Q1.2)
Remote: controller (U4.25), Remote (R27.2 R28.2)
SCL: aLCD (J7.3), controller (5 pins)
SDA: aLCD (J7.1), controller (5 pins)
uRX: controller (U4.46), GSM (R32.1)
uTX: controller (U4.45), GSM (R33.1)